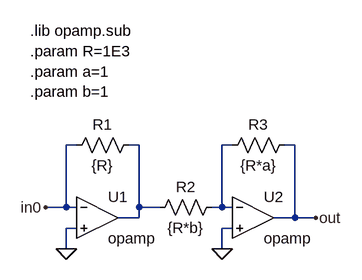
[diagram p0: schematic summer_sj.asc]
summer_sj.asc, the LTspice schematic file:
Version 4
SHEET 1 880 680
WIRE 176 416 160 416
WIRE 272 416 256 416
WIRE 416 416 400 416
WIRE 512 416 496 416
WIRE 160 512 160 416
WIRE 160 512 128 512
WIRE 176 512 160 512
WIRE 272 512 272 416
WIRE 304 512 272 512
WIRE 400 512 400 416
WIRE 400 512 384 512
WIRE 416 512 400 512
WIRE 272 528 272 512
WIRE 272 528 240 528
WIRE 512 528 512 416
WIRE 512 528 480 528
WIRE 544 528 512 528
WIRE 176 544 160 544
WIRE 416 544 400 544
WIRE 160 576 160 544
WIRE 400 576 400 544
FLAG 128 512 in0
FLAG 544 528 out
FLAG 160 576 0
FLAG 400 576 0
SYMBOL OpAmps/opamp 208 464 R0
SYMATTR InstName U1
SYMBOL res 272 400 R90
WINDOW 0 0 56 VBottom 2
WINDOW 3 32 56 VTop 2
SYMATTR InstName R1
SYMATTR Value {R}
SYMBOL OpAmps/opamp 448 464 R0
SYMATTR InstName U2
SYMBOL res 400 496 R90
WINDOW 0 0 56 VBottom 2
WINDOW 3 32 56 VTop 2
SYMATTR InstName R2
SYMATTR Value {R*b}
SYMBOL res 512 400 R90
WINDOW 0 0 56 VBottom 2
WINDOW 3 32 56 VTop 2
SYMATTR InstName R3
SYMATTR Value {R*a}
TEXT 104 240 Left 2 !.lib opamp.sub\n.param R=1E3\n.param a=1\n.param b=1

The netlist it stands for:
* summer_sj.asc
XU1 in0 0 N001 opamp Aol=100K GBW=10Meg  ; pins invin noninvin out
R1 N001 in0 {R}
XU2 N002 0 out opamp Aol=100K GBW=10Meg  ; pins invin noninvin out
R2 N002 N001 {R*b}
R3 out N002 {R*a}
.lib opamp.sub
.param R=1E3
.param a=1
.param b=1
.backanno
.end